# EAGLE design Chaturayana FIX (EAGLE 9.6.2)
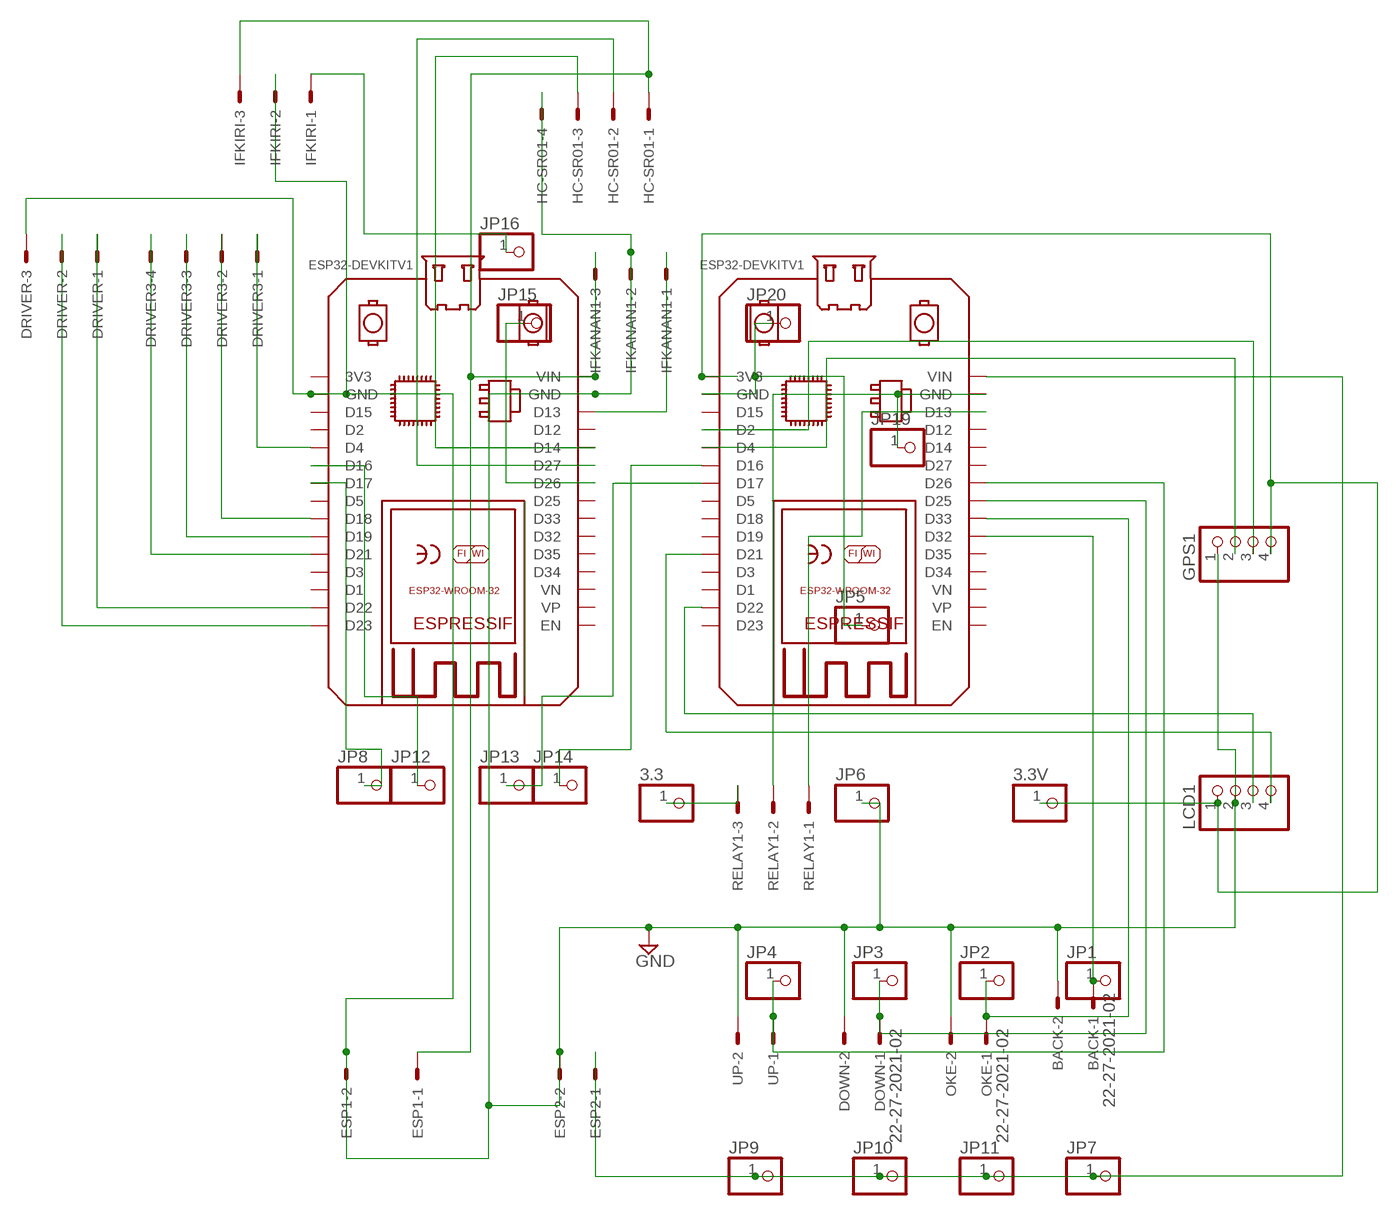
[diagram p0: schematic, sheet 1]

## Parts
3.3  PINHD-1X1  [1X01]
3.3V  PINHD-1X1  [1X01]
BACK  22-27-2021-02  [6410-02]
BOARD2  ESP32DEVKITV1  [ESP32-DEVKITV1]
BOARD3  ESP32DEVKITV1  [ESP32-DEVKITV1]
DOWN  22-27-2021-02  [6410-02]
DRIVER  22-27-2031-03  [6410-03]
DRIVER3  22-27-2041-04  [6410-04]
ESP1  22-27-2021-02  [6410-02]
ESP2  22-27-2021-02  [6410-02]
GPS1  PINHD-1X4  [1X04]
HC-SR01  22-27-2041-04  [6410-04]
IFKANAN1  22-27-2031-03  [6410-03]
IFKIRI  22-27-2031-03  [6410-03]
JP1  PINHD-1X1  [1X01]
JP2  PINHD-1X1  [1X01]
JP3  PINHD-1X1  [1X01]
JP4  PINHD-1X1  [1X01]
JP5  PINHD-1X1  [1X01]
JP6  PINHD-1X1  [1X01]
JP7  PINHD-1X1  [1X01]
JP8  PINHD-1X1  [1X01]
JP9  PINHD-1X1  [1X01]
JP10  PINHD-1X1  [1X01]
JP11  PINHD-1X1  [1X01]
JP12  PINHD-1X1  [1X01]
JP13  PINHD-1X1  [1X01]
JP14  PINHD-1X1  [1X01]
JP15  PINHD-1X1  [1X01]
JP16  PINHD-1X1  [1X01]
JP19  PINHD-1X1  [1X01]
JP20  PINHD-1X1  [1X01]
LCD1  PINHD-1X4  [1X04]
OKE  22-27-2021-02  [6410-02]
RELAY1  22-27-2031-03  [6410-03]
UP  22-27-2021-02  [6410-02]

## Nets
2: BOARD3.D2 GPS1.3
4: BOARD2.D4 DRIVER3.1
4.: BOARD3.D4 GPS1.2
13: BOARD2.D13 IFKANAN1.1
13.: BOARD3.D13 RELAY1.1
14: BOARD2.D14 HC-SR01.3
16: BOARD3.D16 JP14.1
16..: BOARD2.D16 JP12.1
17: BOARD2.D17 JP8.1
17.: BOARD3.D17 JP13.1
18: BOARD2.D18 DRIVER3.2
19: BOARD2.D19 DRIVER3.3
21: BOARD2.D21 DRIVER3.4
21.: BOARD3.D21 LCD1.4
22: BOARD2.D22 DRIVER.1
22.: BOARD3.D22 LCD1.3
23: BOARD2.D23 DRIVER.2
25: BOARD3.D25 DOWN.1 JP3.1
26.: BOARD2.D26 JP15.1
26..: BOARD3.D26 JP4.1 UP.1
27: BOARD2.D27 HC-SR01.2
32: BACK.1 BOARD3.D32 JP1.1
33: BOARD3.D33 JP2.1 OKE.1
GND: BACK.2 BOARD2.GND BOARD2.GND@1(GND) DOWN.2 DRIVER.3 ESP1.2 ESP2.2 GPS1.1 HC-SR01.4 IFKANAN1.2 IFKIRI.2 JP6.1 LCD1.2 OKE.2 UP.2
N$1: IFKIRI.1 JP16.1
N$2: BOARD3.GND JP19.1 RELAY1.2
N$3: 3.3.1 RELAY1.3
N$4: 3.3V.1 BOARD3.3V3 GPS1.4 LCD1.1
N$13: BOARD3.GND@1(GND) JP5.1 JP20.1
N$21: BOARD2.VIN ESP1.1 HC-SR01.1 IFKANAN1.3 IFKIRI.3
VCC: BOARD3.VIN ESP2.1 JP7.1 JP9.1 JP10.1 JP11.1
Unconnected: BOARD2.3V3 BOARD2.D1 BOARD2.D2 BOARD2.D3 BOARD2.D5 BOARD2.D12 BOARD2.D15 BOARD2.D25 BOARD2.D32 BOARD2.D33 BOARD2.D34 BOARD2.D35 BOARD2.EN BOARD2.VN BOARD2.VP BOARD3.D1 BOARD3.D3 BOARD3.D5 BOARD3.D12 BOARD3.D14 BOARD3.D15 BOARD3.D18 BOARD3.D19 BOARD3.D23 BOARD3.D27 BOARD3.D34 BOARD3.D35 BOARD3.EN BOARD3.VN BOARD3.VP

## Library data of the parts
3.3 3.3V JP1-JP16 JP19 JP20 = pinhead:PINHD-1X1: PIN HEADER
BACK DOWN ESP1 ESP2 OKE UP = con-molex:22-?-02: CONNECTOR wire to board 2.54 mm (.1 inch) pitch header; MF: MOLEX; OC_FARNELL: unknown; OC_NEWARK: unknown
BOARD2 BOARD3 = ESP32-DEVKITV1:ESP32DEVKITV1: https://github.com/shridattdudhat
DRIVER IFKANAN1 IFKIRI RELAY1 = con-molex:22-?-03: CONNECTOR wire to board 2.54 mm (.1 inch) pitch header; MF: MOLEX; OC_FARNELL: unknown; OC_NEWARK: unknown
DRIVER3 HC-SR01 = con-molex:22-?-04: CONNECTOR wire to board 2.54 mm (.1 inch) pitch header; MF: MOLEX; OC_FARNELL: unknown; OC_NEWARK: unknown
GPS1 LCD1 = pinhead:PINHD-1X4: PIN HEADER

## Board
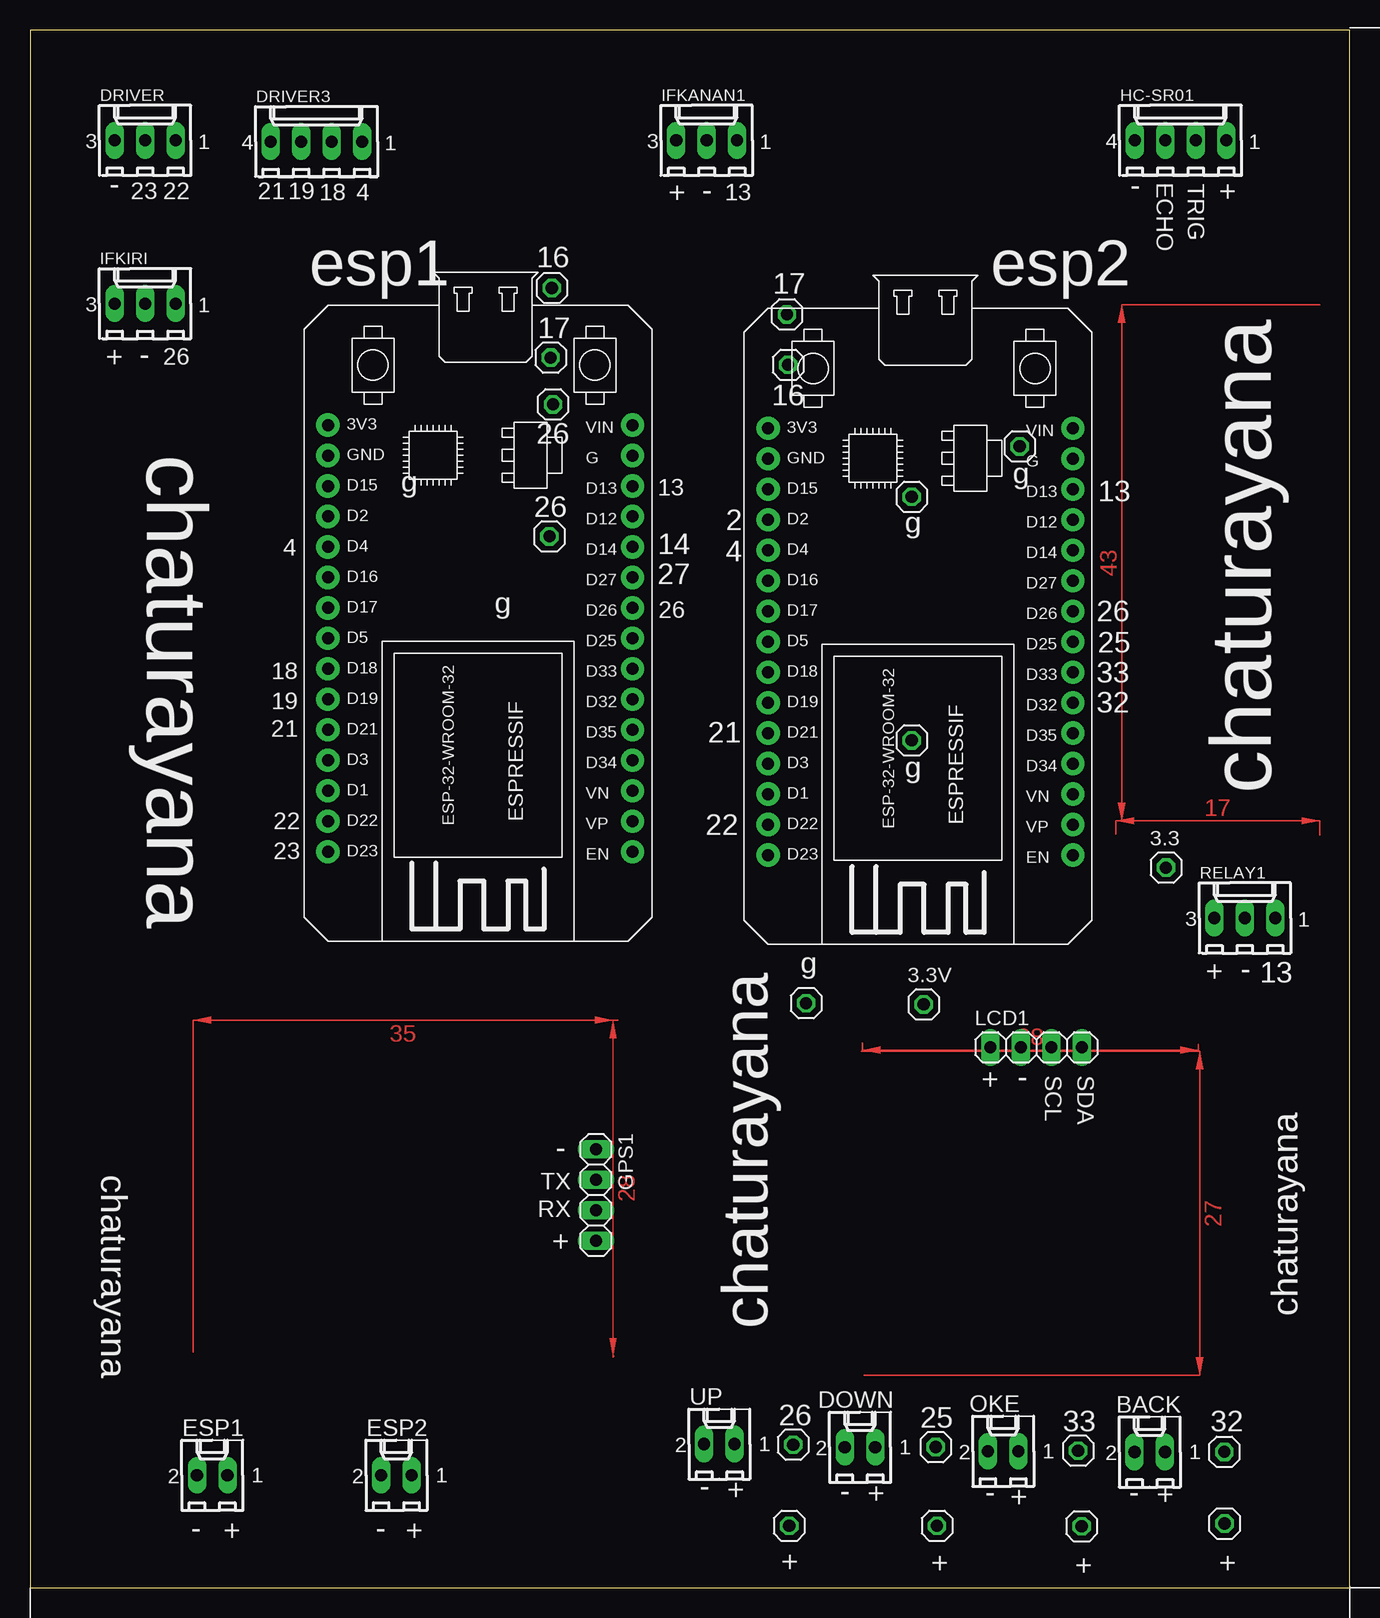
[diagram p1: board, top side]
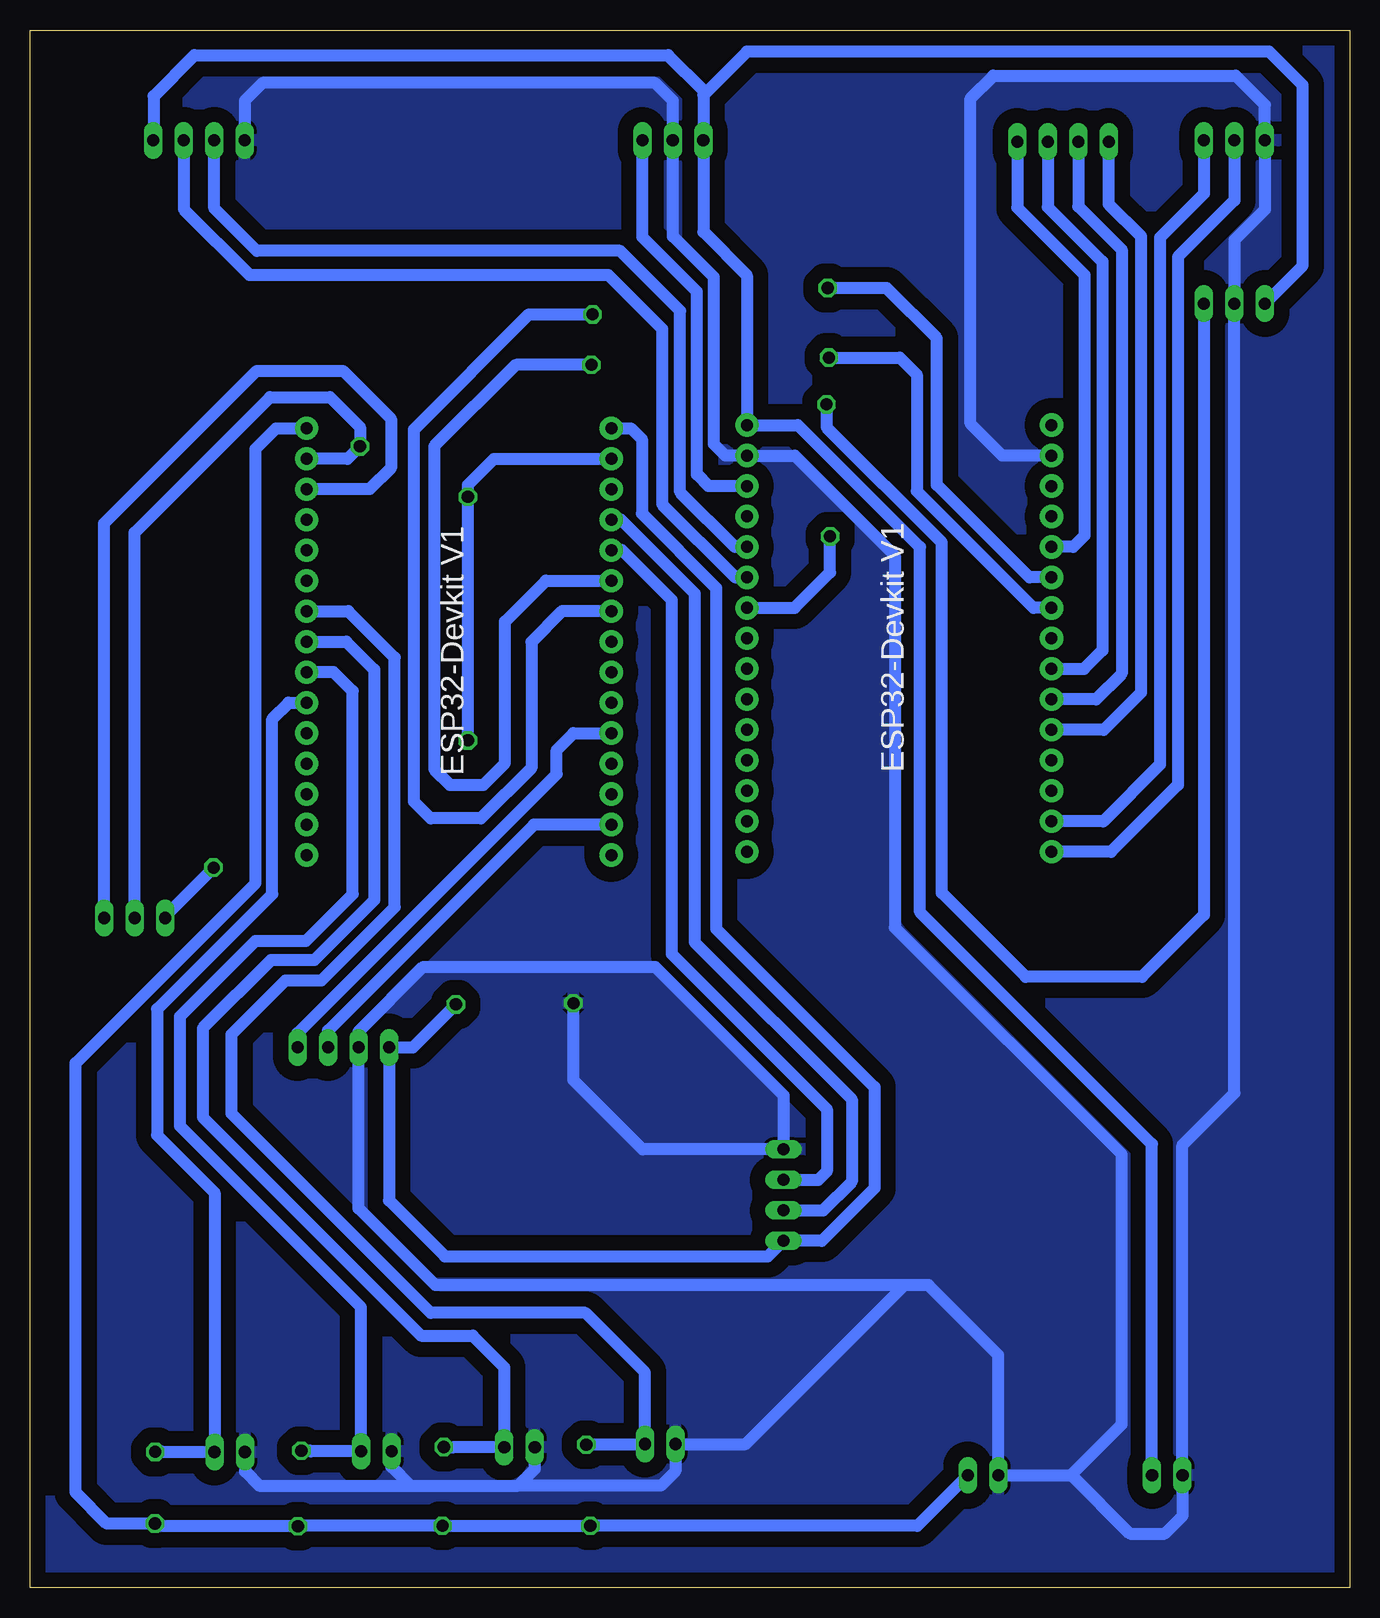
[diagram p2: board, bottom side, seen from below]

Size 110 x 129.8 mm. Coordinates in mm from the lower left corner, seen from the top.
Outline: 0,0 110,0 110,129.8 0,129.8 0,0
Copper layers (1*16): Top 0.035mm / dielectric 1.5mm / Bottom 0.035mm
Design rules "default": minimum track width 6mil, minimum drill 0.35mm, track to track 6mil, track to pad 6mil, pad to pad 6mil, via to via 6mil, smd to smd 6mil, copper to edge 40mil, drill to drill 6mil, minimum pad ring 10mil, minimum via ring 8mil, stop-mask expansion 4mil, vias tented up to drill 0mil, thermal gap 10mil

### Footprints (pad centres in the part's own frame; a part is rotated, then mirrored left to right if it is on the bottom)
1X01 = drill 1.016 octagon: 1 0,0
6410-02 = drill 1.016 long: 1 1.27,0; 2 -1.27,0
ESP32-DEVKITV1 = drill 1 pad 1.93: 3V3 0,0; D1 30.48,0; D2 7.62,0; D3 27.94,0; D4 10.16,0; D5 17.78,0; D12 7.62,25.4; D13 5.08,25.4; D14 10.16,25.4; D15 5.08,0; D16 12.7,0; D17 15.24,0; D18 20.32,0; D19 22.86,0; D21 25.4,0; D22 33.02,0; D23 35.56,0; D25 17.78,25.4; D26 15.24,25.4; D27 12.7,25.4; D32 22.86,25.4; D33 20.32,25.4; D34 27.94,25.4; D35 25.4,25.4; EN 35.56,25.4; GND 2.54,25.4; GND@1 2.54,0; VIN 0,25.4; VN 30.48,25.4; VP 33.02,25.4
6410-03 = drill 1.016 long: 1 2.54,0; 2 0,0; 3 -2.54,0
6410-04 = drill 1.016 long: 1 3.81,0; 2 1.27,0; 3 -1.27,0; 4 -3.81,0
1X04 = drill 1.016 long: 1 -3.81,0; 2 -1.27,0; 3 1.27,0; 4 3.81,0

### Placement (x,y rotation side)
3.3  94.7,60 0 top
3.3V  74.5,48.6 0 top
BACK  93.35,11.3 0 top
BOARD2  24.84,96.88 270 top
BOARD3  61.54,96.61 270 top
DOWN  69.19,11.7 0 top
DRIVER  9.6,120.6 0 top
DRIVER3  23.88,120.5 0 top
ESP1  15.19,9.36 0 top
ESP2  30.55,9.36 0 top
GPS1  47.18,32.71 270 top
HC-SR01  95.91,120.6 0 top
IFKANAN1  56.41,120.6 0 top
IFKIRI  9.6,107 0 top
JP1  99.56,11.31 0 top
JP2  87.38,11.41 0 top
JP3  75.5,11.71 0 top
JP4  63.62,11.91 0 top
JP5  73.5,70.6 0 top
JP6  64.7,48.7 0 top
JP7  99.59,5.34 90 top
JP8  43.4,102.5 0 top
JP9  87.66,5.11 0 top
JP10  63.29,5.15 0 top
JP11  75.61,5.15 0 top
JP12  43.5,108.3 0 top
JP13  63.1,106.1 0 top
JP14  63.2,101.9 0 top
JP15  43.3,87.6 0 top
JP16  43.6,98.6 0 top
JP19  82.5,95.1 0 top
JP20  73.5,90.9 0 top
LCD1  83.88,45.02 0 top
OKE  81.13,11.36 0 top
RELAY1  101.28,55.8 0 top
UP  57.47,11.96 0 top

### Tracks (layer width: path | path; a pad name or v marks a point on that pad's centre or on a via)
2
  Bottom 1.016: BOARD3.D2 60.74,88.99 54.6,82.85 54.6,53.8 41.48,40.68 41.48,33.84 43.88,31.44 GPS1.3
4
  Bottom 1.016: DRIVER3.1 27.69,114.99 22.1,109.4 22.1,87.66 23.04,86.72 BOARD2.D4
4.
  Bottom 1.016: GPS1.2 44.28,33.98 43.58,34.68 43.58,39.88 56.5,52.8 56.5,82.3 60.65,86.45 BOARD3.D4
13
  Bottom 1.016: BOARD2.D13 53.44,91.8 54.4,92.76 54.4,108 58.95,112.55 IFKANAN1.1
13.
  Bottom 1.016: RELAY1.1 103.82,88.68 91.1,101.4 83.9,101.4 79.9,97.4 79.9,93.3 81.67,91.53 BOARD3.D13 86.91,91.5
14
  Bottom 1.016: BOARD2.D14 51.22,86.72 55.8,91.3 55.8,106.4 60.8,111.4 91.1,111.4 94.64,114.94 HC-SR01.3
16
  Bottom 1.016: JP14.1 69.5,101.9 76.3,95.1 76.3,68.2 75,66.9 72.2,66.9 70.4,68.7 70.4,80.5 66.99,83.91 BOARD3.D16
16..
  Bottom 1.016: BOARD2.D16 26.68,84.18 34.4,91.9 34.4,104.1 38.6,108.3 JP12.1
17
  Bottom 1.016: BOARD2.D17 26.34,81.64 36.08,91.38 36.08,101.09 37.49,102.5 JP8.1
17.
  Bottom 1.016: JP13.1 68.4,106.1 78,96.5 78,65.5 76.6,64.1 72.4,64.1 68.2,68.3 68.2,78.8 65.63,81.37 BOARD3.D17
18
  Bottom 1.016: DRIVER3.2 25.15,115.05 20.6,110.5 20.6,78.1 22.14,76.56 BOARD2.D18
19
  Bottom 1.016: DRIVER3.3 22.61,115.11 19,111.5 19,76.16 21.14,74.02 BOARD2.D19
21
  Bottom 1.016: BOARD2.D21 20.49,71.48 17.37,74.6 17.37,112.6 20.07,115.3 DRIVER3.4
21.
  Bottom 1.016: 87.69,46.11 LCD1.4 87.69,46.21 66.1,67.8 66.1,69.8 64.69,71.21 BOARD3.D21
22
  Bottom 1.016: DRIVER.1 12.14,116.16 15.8,112.5 15.8,68.6 20.54,63.86 BOARD2.D22
22.
  Bottom 1.016: LCD1.3 85.15,46.42 67.98,63.59 BOARD3.D22
23
  Bottom 1.016: DRIVER.2 9.6,115.6 14.3,110.9 14.3,66.9 19.88,61.32 BOARD2.D23
25
  Bottom 1.016: JP3.1 74.67,11.71 74.66,11.7 DOWN.1 70.46,18.36 73.1,21 77.4,21 95.6,39.2 95.6,46.6 89.9,52.3 86.3,52.3 81.3,57.3 81.3,76.5 83.63,78.83 BOARD3.D25
26.
  Bottom 1.016: BOARD2.D26 46.26,81.64 43.3,84.6 JP15.1
26..
  Bottom 1.016: JP4.1 63.57,11.96 UP.1 58.74,17.94 63.7,22.9 76.6,22.9 93.2,39.5 93.2,46.1 88.7,50.6 85.7,50.6 79.6,56.7 79.6,77.5 83.47,81.37 BOARD3.D26
27
  Bottom 1.016: HC-SR01.2 97.18,114.88 91.7,109.4 61.8,109.4 57.3,104.9 57.3,90.3 51.18,84.18 BOARD2.D27
32
  Bottom 1.016: JP1.1 98.91,11.31 98.9,11.3 BACK.1 94.62,32.92 99.4,37.7 99.4,48.2 89.8,57.8 89.8,72.4 88.45,73.75 BOARD3.D32
33
  Bottom 1.016: JP2.1 86.65,11.41 86.6,11.36 OKE.1 82.4,23.36 97.5,38.46 97.5,47.6 91.2,53.9 87,53.9 83.1,57.8 83.1,74.7 84.7,76.3 BOARD3.D33
GND
  Bottom 1.016: 69.3,8.5 57.4,8.5 56.2,9.7 UP.2 50.34,11.96 37.1,25.2 | 37.1,25.2 35.1,25.2 29.28,19.38 ESP2.2 23.16,9.36 | 37.1,25.2 76.2,25.2 82.61,31.61 LCD1.2 82.61,46.32 77.21,51.72 57.88,51.72 47.18,41.02 GPS1.1 58.92,36.52 64.7,42.3 JP6.1 | DOWN.2 67.92,9.88 69.3,8.5 | BACK.2 92.08,9.68 90.9,8.5 78.3,8.5 | 78.3,8.5 69.3,8.5 | OKE.2 79.86,10.06 78.3,8.5 | 23.16,9.36 18.3,4.5 15.4,4.5 13.9,6 13.9,9.34 ESP1.2 13.92,36.88 9.6,41.2 IFKIRI.2 9.6,112.3 7.06,114.84 DRIVER.3 7.06,123.56 9.5,126 29.7,126 31.6,124.1 31.6,97 28.94,94.34 BOARD2.GND@1 | HC-SR01.4 92.1,123.9 90.6,125.4 57.9,125.4 56.41,123.91 IFKANAN1.2 56.41,112.61 53,109.2 53,95.3 52.04,94.34 BOARD2.GND 46.24,94.34 37.9,86 37.9,55 19,36.1 19,13.6 23.16,9.44 23.16,9.36
  pour Bottom (isolate 1.27): 0.3,0.2 109.6,0.2 109.6,129.4 0.4,129.4 0.3,129.5
N$1
  Bottom 1.016: IFKIRI.1 12.14,56.06 17.3,50.9 27,50.9 34,57.9 34,87.1 43.6,96.7 JP16.1
N$2
  Bottom 1.016: RELAY1.2 101.28,87.92 90,99.2 85,99.2 82.5,96.7 JP19.1 83.53,94.07 BOARD3.GND
N$3
  Bottom 1.016: 3.3.1 98.74,55.96 RELAY1.3
N$4
  Bottom 1.016: BOARD3.3V3 59.91,96.61 59,95.7 59,89.5 52.8,83.3 52.8,54.9 39.6,41.7 39.6,33.3 44,28.9 GPS1.4 48.48,27.6 75.4,27.6 80.07,32.27 LCD1.1 78.08,45.02 3.3V.1
N$13
  Bottom 1.016: JP5.1 JP20.1 73.5,91.9 71.33,94.07 BOARD3.GND@1
N$21
  Bottom 1.016: IFKANAN1.3 53.87,112.97 50.24,109.34 BOARD2.VIN 45.98,96.88 35.8,86.7 35.8,56.3 16.46,36.96 ESP1.1 | IFKANAN1.3 53.87,121.47 | HC-SR01.1 99.7,120.62 99.7,124.3 96.3,127.7 56.8,127.7 53.87,124.77 53.87,124.37 | IFKIRI.3 3.9,110.16 3.9,125.2 6.7,128 50.24,128 53.87,124.37 | 53.87,124.37 IFKANAN1.3
VCC
  Bottom 1.016: JP11.1 JP10.1 36.03,5.15 ESP2.1 | 87.7,5.15 JP9.1 99.36,5.11 JP7.1 103.59,5.34 106.2,7.95 106.2,43.7 91.2,58.7 91.2,94.9 89.49,96.61 BOARD3.VIN | JP11.1 75.81,5.35 | JP11.1 87.7,5.15 | 87.7,5.15 87.75,5.2
(copper drawn outside any net)
  shapes: Top area x6

### Text on the board
tNames: ECHO | TRIG | - | 23 | 22 | 21 | 19 | 18 | 4 | - | 13 | - | + | + | 16 | esp1 | 17 | esp2 | chaturayana | 17 | + | - | 26 | 16 | 26 | chaturayana | g | g | 13 | 13 | 26 | 2 | g | 4 | 14 | 4 | 27 | g | 26 | 26 | 25 | 18 | 33 | 19 | 32 | 21 | 21 | g | 22 | 22 | 23 | g | - | + | 13 | SCL | SDA | + | - | chaturayana | - | TX | chaturayana | RX | + | chaturayana | 26 | 25 | 33 | 32 | - | + | - | + | - | + | - | + | - | + | - | + | + | + | + | +